# Altium schematic sheet Solar Schematic.SchDoc
size A
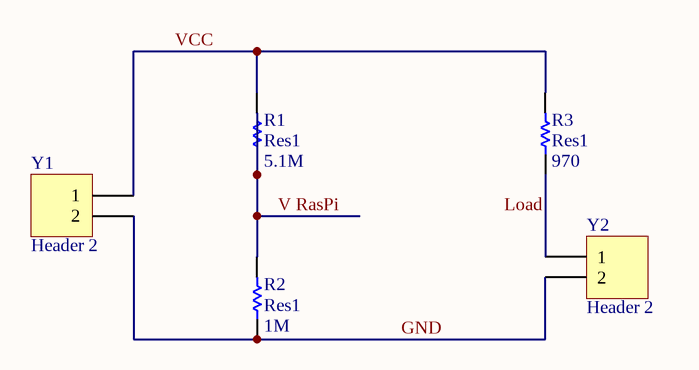
[diagram p0: Solar Schematic.SchDoc]

## Parts
R1  Res1  value 5.1M  [AXIAL-0.3]
R2  Res1  value 1M  [AXIAL-0.3]
R3  Res1  value 970  [AXIAL-0.3]
Y1  Header 2  [HDR1X2]
Y2  Header 2  [HDR1X2]

## Nets
GND: R2.1 Y1.2 Y2.2
V RasPi: R1.1 R2.2
VCC: R1.2 R3.2 Y1.1
NetR3_1: R3.1 Y2.1

## Notes on the sheet
- Labels drawn without touching a wire or pin: Load

## Library data of the parts
R1-R3 = Res1: Resistor; Published: 8-Jun-2000; LatestRevisionDate: 17-Jul-2002; LatestRevisionNote: Re-released for DXP Platform.; PackageReference: AXIAL-0.3; Publisher: Altium Limited; PackageDescription: Axial Device, Thru-Hole; 2 Leads; 0.3 in Pin Spacing
Y1 Y2 = Header 2: Header, 2-Pin; LatestRevisionDate: 17-Jul-2002; LatestRevisionNote: Re-released for DXP Platform.; Publisher: Altium Limited